# EAGLE design Flipdot_Driver (EAGLE 9.3.2)
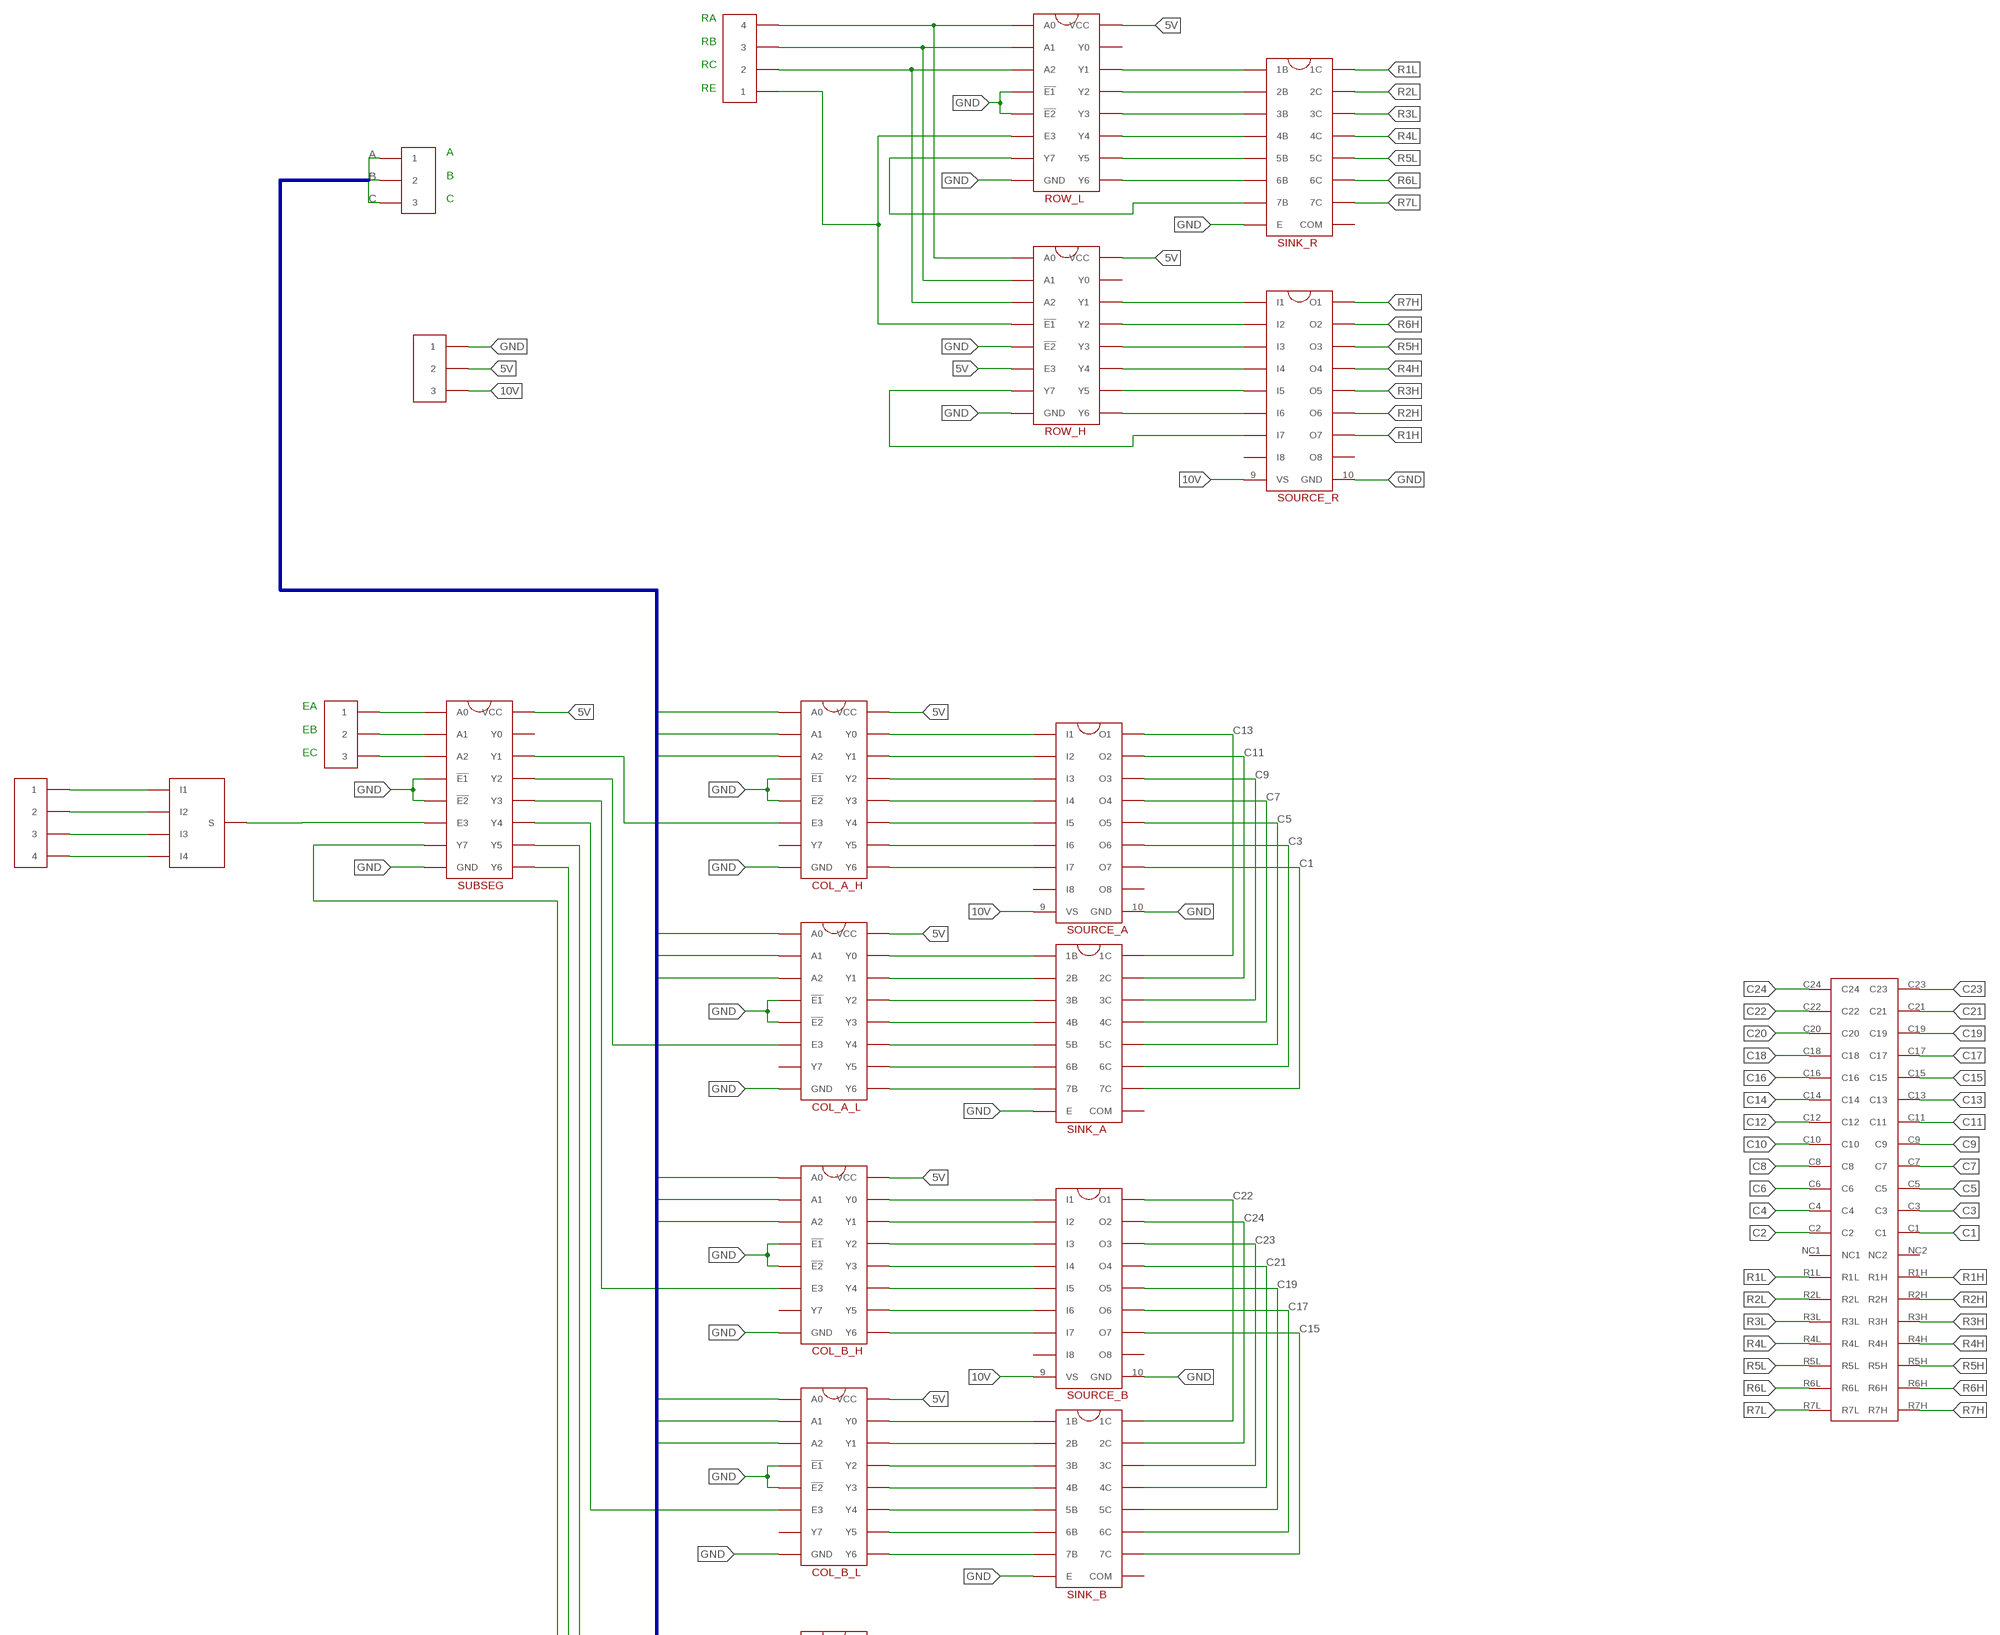
[diagram p0: schematic, sheet 1, part 1 of 2]
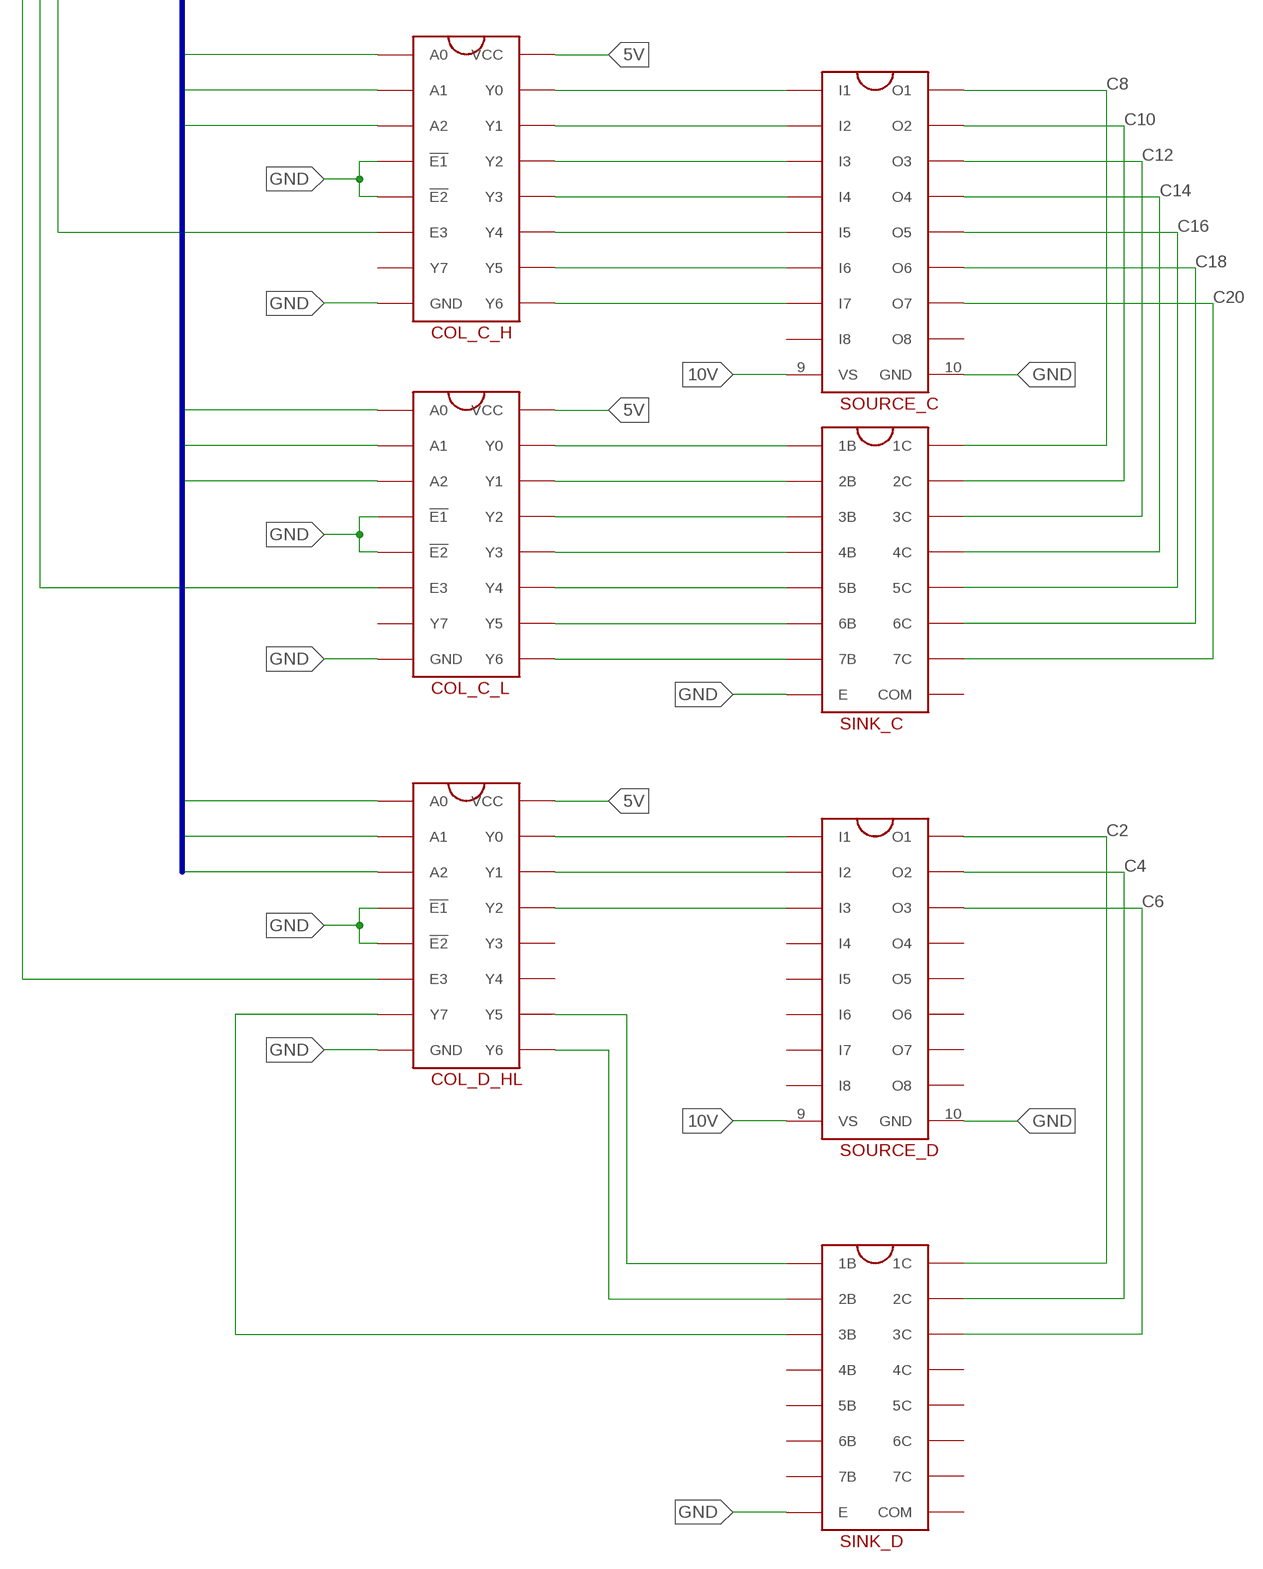
[diagram p1: schematic, sheet 1, part 2 of 2]

## Parts
COL_A_H  74HC238  [DIL16]
COL_A_L  74HC238  [DIL16]
COL_B_H  74HC238  [DIL16]
COL_B_L  74HC238  [DIL16]
COL_C_H  74HC238  [DIL16]
COL_C_L  74HC238  [DIL16]
COL_D_HL  74HC238  [DIL16]
ROW_H  74HC238  [DIL16]
ROW_L  74HC238  [DIL16]
SINK_A  ULN2003A  [DIL16]
SINK_B  ULN2003A  [DIL16]
SINK_C  ULN2003A  [DIL16]
SINK_D  ULN2003A  [DIL16]
SINK_R  ULN2003A  [DIL16]
SOURCE_A  UDN2981A  [DIL18]
SOURCE_B  UDN2981A  [DIL18]
SOURCE_C  UDN2981A  [DIL18]
SOURCE_D  UDN2981A  [DIL18]
SOURCE_R  UDN2981A  [DIL18]
SUBSEG  74HC238  [DIL16]
U$1  HEADER_40  [HEADER_40]
U$2  3_PIN  [3_PIN]
U$3  3_PIN  [3_PIN]
U$5  3_PIN  [3_PIN]
U$6  4_PIN  [4_PIN]
U$10  JUMPER  [JUMPER]
U$11  4_PIN  [4_PIN]

## Nets
5V: COL_A_H.16(VCC) COL_A_L.16(VCC) COL_B_H.16(VCC) COL_B_L.16(VCC) COL_C_H.16(VCC) COL_C_L.16(VCC) COL_D_HL.16(VCC) ROW_H.6(E3) ROW_H.16(VCC) ROW_L.16(VCC) SUBSEG.16(VCC) U$5.P$2
10V: SOURCE_A.9(VS) SOURCE_B.9(VS) SOURCE_C.9(VS) SOURCE_D.9(VS) SOURCE_R.9(VS) U$5.P$3
A: COL_A_H.1(A0) COL_A_L.1(A0) COL_B_H.1(A0) COL_B_L.1(A0) COL_C_H.1(A0) COL_C_L.1(A0) COL_D_HL.1(A0) U$2.P$1
B: COL_A_H.2(A1) COL_A_L.2(A1) COL_B_H.2(A1) COL_B_L.2(A1) COL_C_H.2(A1) COL_C_L.2(A1) COL_D_HL.2(A1) U$2.P$2
C: COL_A_H.3(A2) COL_A_L.3(A2) COL_B_H.3(A2) COL_B_L.3(A2) COL_C_H.3(A2) COL_C_L.3(A2) COL_D_HL.3(A2) U$2.P$3
C1: SINK_A.10(7C) SOURCE_A.12(O7) U$1.C1
C2: SINK_D.16(1C) SOURCE_D.18(O1) U$1.C2
C3: SINK_A.11(6C) SOURCE_A.13(O6) U$1.C3
C4: SINK_D.15(2C) SOURCE_D.17(O2) U$1.C4
C5: SINK_A.12(5C) SOURCE_A.14(O5) U$1.C5
C6: SINK_D.14(3C) SOURCE_D.16(O3) U$1.C6
C7: SINK_A.13(4C) SOURCE_A.15(O4) U$1.C7
C8: SINK_C.16(1C) SOURCE_C.18(O1) U$1.C8
C9: SINK_A.14(3C) SOURCE_A.16(O3) U$1.C9
C10: SINK_C.15(2C) SOURCE_C.17(O2) U$1.C10
C11: SINK_A.15(2C) SOURCE_A.17(O2) U$1.C11
C12: SINK_C.14(3C) SOURCE_C.16(O3) U$1.C12
C13: SINK_A.16(1C) SOURCE_A.18(O1) U$1.C13
C14: SINK_C.13(4C) SOURCE_C.15(O4) U$1.C14
C15: SINK_B.10(7C) SOURCE_B.12(O7) U$1.C15
C16: SINK_C.12(5C) SOURCE_C.14(O5) U$1.C16
C17: SINK_B.11(6C) SOURCE_B.13(O6) U$1.C17
C18: SINK_C.11(6C) SOURCE_C.13(O6) U$1.C18
C19: SINK_B.12(5C) SOURCE_B.14(O5) U$1.C19
C20: SINK_C.10(7C) SOURCE_C.12(O7) U$1.C20
C21: SINK_B.13(4C) SOURCE_B.15(O4) U$1.C21
C22: SINK_B.16(1C) SOURCE_B.18(O1) U$1.C22
C23: SINK_B.14(3C) SOURCE_B.16(O3) U$1.C23
C24: SINK_B.15(2C) SOURCE_B.17(O2) U$1.C24
GND: COL_A_H.4(!E1) COL_A_H.5(!E2) COL_A_H.8(GND) COL_A_L.4(!E1) COL_A_L.5(!E2) COL_A_L.8(GND) COL_B_H.4(!E1) COL_B_H.5(!E2) COL_B_H.8(GND) COL_B_L.4(!E1) COL_B_L.5(!E2) COL_B_L.8(GND) COL_C_H.4(!E1) COL_C_H.5(!E2) COL_C_H.8(GND) COL_C_L.4(!E1) COL_C_L.5(!E2) COL_C_L.8(GND) COL_D_HL.4(!E1) COL_D_HL.5(!E2) COL_D_HL.8(GND) ROW_H.5(!E2) ROW_H.8(GND) ROW_L.4(!E1) ROW_L.5(!E2) ROW_L.8(GND) SINK_A.8(E) SINK_B.8(E) SINK_C.8(E) SINK_D.8(E) SINK_R.8(E) SOURCE_A.10(GND) SOURCE_B.10(GND) SOURCE_C.10(GND) SOURCE_D.10(GND) SOURCE_R.10(GND) SUBSEG.4(!E1) SUBSEG.5(!E2) SUBSEG.8(GND) U$5.P$1
N$1: U$10.S1(I1) U$11.P$1
N$2: U$10.S2(I2) U$11.P$2
N$3: U$10.S3(I3) U$11.P$3
N$4: SUBSEG.1(A0) U$3.P$1
N$5: SUBSEG.2(A1) U$3.P$2
N$6: SUBSEG.3(A2) U$3.P$3
N$7: COL_A_L.6(E3) SUBSEG.13(Y2)
N$8: COL_B_H.6(E3) SUBSEG.12(Y3)
N$9: COL_A_H.6(E3) SUBSEG.14(Y1)
N$10: COL_B_L.6(E3) SUBSEG.11(Y4)
N$11: COL_C_H.6(E3) SUBSEG.10(Y5)
N$12: COL_C_L.6(E3) SUBSEG.9(Y6)
N$13: COL_D_HL.6(E3) SUBSEG.7(Y7)
N$14: COL_A_H.15(Y0) SOURCE_A.1(I1)
N$15: COL_A_H.14(Y1) SOURCE_A.2(I2)
N$16: COL_A_H.13(Y2) SOURCE_A.3(I3)
N$17: COL_A_H.12(Y3) SOURCE_A.4(I4)
N$18: COL_A_H.11(Y4) SOURCE_A.5(I5)
N$19: COL_A_H.10(Y5) SOURCE_A.6(I6)
N$20: COL_A_H.9(Y6) SOURCE_A.7(I7)
N$21: COL_B_H.15(Y0) SOURCE_B.1(I1)
N$22: COL_B_H.14(Y1) SOURCE_B.2(I2)
N$23: COL_B_H.13(Y2) SOURCE_B.3(I3)
N$24: COL_B_H.12(Y3) SOURCE_B.4(I4)
N$25: COL_B_H.11(Y4) SOURCE_B.5(I5)
N$26: COL_B_H.10(Y5) SOURCE_B.6(I6)
N$27: COL_B_H.9(Y6) SOURCE_B.7(I7)
N$28: COL_C_H.15(Y0) SOURCE_C.1(I1)
N$29: COL_C_H.14(Y1) SOURCE_C.2(I2)
N$30: COL_C_H.13(Y2) SOURCE_C.3(I3)
N$31: COL_C_H.12(Y3) SOURCE_C.4(I4)
N$32: COL_C_H.11(Y4) SOURCE_C.5(I5)
N$33: COL_C_H.10(Y5) SOURCE_C.6(I6)
N$34: COL_C_H.9(Y6) SOURCE_C.7(I7)
N$35: COL_D_HL.15(Y0) SOURCE_D.1(I1)
N$36: COL_D_HL.14(Y1) SOURCE_D.2(I2)
N$37: COL_D_HL.13(Y2) SOURCE_D.3(I3)
N$38: COL_A_L.15(Y0) SINK_A.1(1B)
N$39: COL_A_L.14(Y1) SINK_A.2(2B)
N$40: COL_A_L.13(Y2) SINK_A.3(3B)
N$41: COL_A_L.12(Y3) SINK_A.4(4B)
N$42: COL_A_L.11(Y4) SINK_A.5(5B)
N$43: COL_A_L.10(Y5) SINK_A.6(6B)
N$44: COL_A_L.9(Y6) SINK_A.7(7B)
N$45: COL_B_L.15(Y0) SINK_B.1(1B)
N$46: COL_B_L.14(Y1) SINK_B.2(2B)
N$47: COL_B_L.13(Y2) SINK_B.3(3B)
N$48: COL_B_L.12(Y3) SINK_B.4(4B)
N$49: COL_B_L.11(Y4) SINK_B.5(5B)
N$50: COL_B_L.10(Y5) SINK_B.6(6B)
N$51: COL_B_L.9(Y6) SINK_B.7(7B)
N$52: COL_C_L.15(Y0) SINK_C.1(1B)
N$53: COL_C_L.14(Y1) SINK_C.2(2B)
N$54: COL_C_L.13(Y2) SINK_C.3(3B)
N$55: COL_C_L.12(Y3) SINK_C.4(4B)
N$56: COL_C_L.11(Y4) SINK_C.5(5B)
N$57: COL_C_L.10(Y5) SINK_C.6(6B)
N$58: COL_C_L.9(Y6) SINK_C.7(7B)
N$59: COL_D_HL.10(Y5) SINK_D.1(1B)
N$60: COL_D_HL.9(Y6) SINK_D.2(2B)
N$61: COL_D_HL.7(Y7) SINK_D.3(3B)
N$62: ROW_H.1(A0) ROW_L.1(A0) U$6.P$4
N$63: ROW_H.2(A1) ROW_L.2(A1) U$6.P$3
N$64: ROW_H.3(A2) ROW_L.3(A2) U$6.P$2
N$65: ROW_H.4(!E1) ROW_L.6(E3) U$6.P$1
N$66: ROW_L.14(Y1) SINK_R.1(1B)
N$67: ROW_L.13(Y2) SINK_R.2(2B)
N$68: ROW_L.12(Y3) SINK_R.3(3B)
N$69: ROW_L.11(Y4) SINK_R.4(4B)
N$70: ROW_L.10(Y5) SINK_R.5(5B)
N$71: ROW_L.9(Y6) SINK_R.6(6B)
N$72: ROW_L.7(Y7) SINK_R.7(7B)
N$73: ROW_H.14(Y1) SOURCE_R.1(I1)
N$74: ROW_H.13(Y2) SOURCE_R.2(I2)
N$75: ROW_H.12(Y3) SOURCE_R.3(I3)
N$76: ROW_H.11(Y4) SOURCE_R.4(I4)
N$77: ROW_H.10(Y5) SOURCE_R.5(I5)
N$78: ROW_H.9(Y6) SOURCE_R.6(I6)
N$79: ROW_H.7(Y7) SOURCE_R.7(I7)
N$80: U$10.S4(I4) U$11.P$4
R1H: SOURCE_R.12(O7) U$1.R1H
R1L: SINK_R.16(1C) U$1.R1L
R2H: SOURCE_R.13(O6) U$1.R2H
R2L: SINK_R.15(2C) U$1.R2L
R3H: SOURCE_R.14(O5) U$1.R3H
R3L: SINK_R.14(3C) U$1.R3L
R4H: SOURCE_R.15(O4) U$1.R4H
R4L: SINK_R.13(4C) U$1.R4L
R5H: SOURCE_R.16(O3) U$1.R5H
R5L: SINK_R.12(5C) U$1.R5L
R6H: SOURCE_R.17(O2) U$1.R6H
R6L: SINK_R.11(6C) U$1.R6L
R7H: SOURCE_R.18(O1) U$1.R7H
R7L: SINK_R.10(7C) U$1.R7L
SEG_1: SUBSEG.6(E3) U$10.X1(S) U$10.X2(S) U$10.X3(S) U$10.X4(S)
Unconnected: COL_A_H.7(Y7) COL_A_L.7(Y7) COL_B_H.7(Y7) COL_B_L.7(Y7) COL_C_H.7(Y7) COL_C_L.7(Y7) COL_D_HL.11(Y4) COL_D_HL.12(Y3) ROW_H.15(Y0) ROW_L.15(Y0) SINK_A.9(COM) SINK_B.9(COM) SINK_C.9(COM) SINK_D.4(4B) SINK_D.5(5B) SINK_D.6(6B) SINK_D.7(7B) SINK_D.9(COM) SINK_D.10(7C) SINK_D.11(6C) SINK_D.12(5C) SINK_D.13(4C) SINK_R.9(COM) SOURCE_A.8(I8) SOURCE_A.11(O8) SOURCE_B.8(I8) SOURCE_B.11(O8) SOURCE_C.8(I8) SOURCE_C.11(O8) SOURCE_D.4(I4) SOURCE_D.5(I5) SOURCE_D.6(I6) SOURCE_D.7(I7) SOURCE_D.8(I8) SOURCE_D.11(O8) SOURCE_D.12(O7) SOURCE_D.13(O6) SOURCE_D.14(O5) SOURCE_D.15(O4) SOURCE_R.8(I8) SOURCE_R.11(O8) SUBSEG.15(Y0) U$1.NC1 U$1.NC2

## Buses
CODE3WIRE:A,B,C

## Notes on the sheet
- RA
  
  RB
  
  RC
  
  RE
- A
  
  B
  
  C
- EA
  
  EB
  
  EC

## Library data of the parts
COL_A_H COL_A_L COL_B_H COL_B_L COL_C_H COL_C_L COL_D_HL ROW_H ROW_L SUBSEG = Flipdot:74HC238: Demultiplexer
SINK_A SINK_B SINK_C SINK_D SINK_R = Flipdot:ULN2003A: Darlington Array
SOURCE_A SOURCE_B SOURCE_C SOURCE_D SOURCE_R = Flipdot:UDN2981A: Source driver
U$1 = Flipdot:HEADER_40
U$2 U$3 U$5 = Flipdot:3_PIN
U$6 U$11 = Flipdot:4_PIN
U$10 = Flipdot:JUMPER

## Board
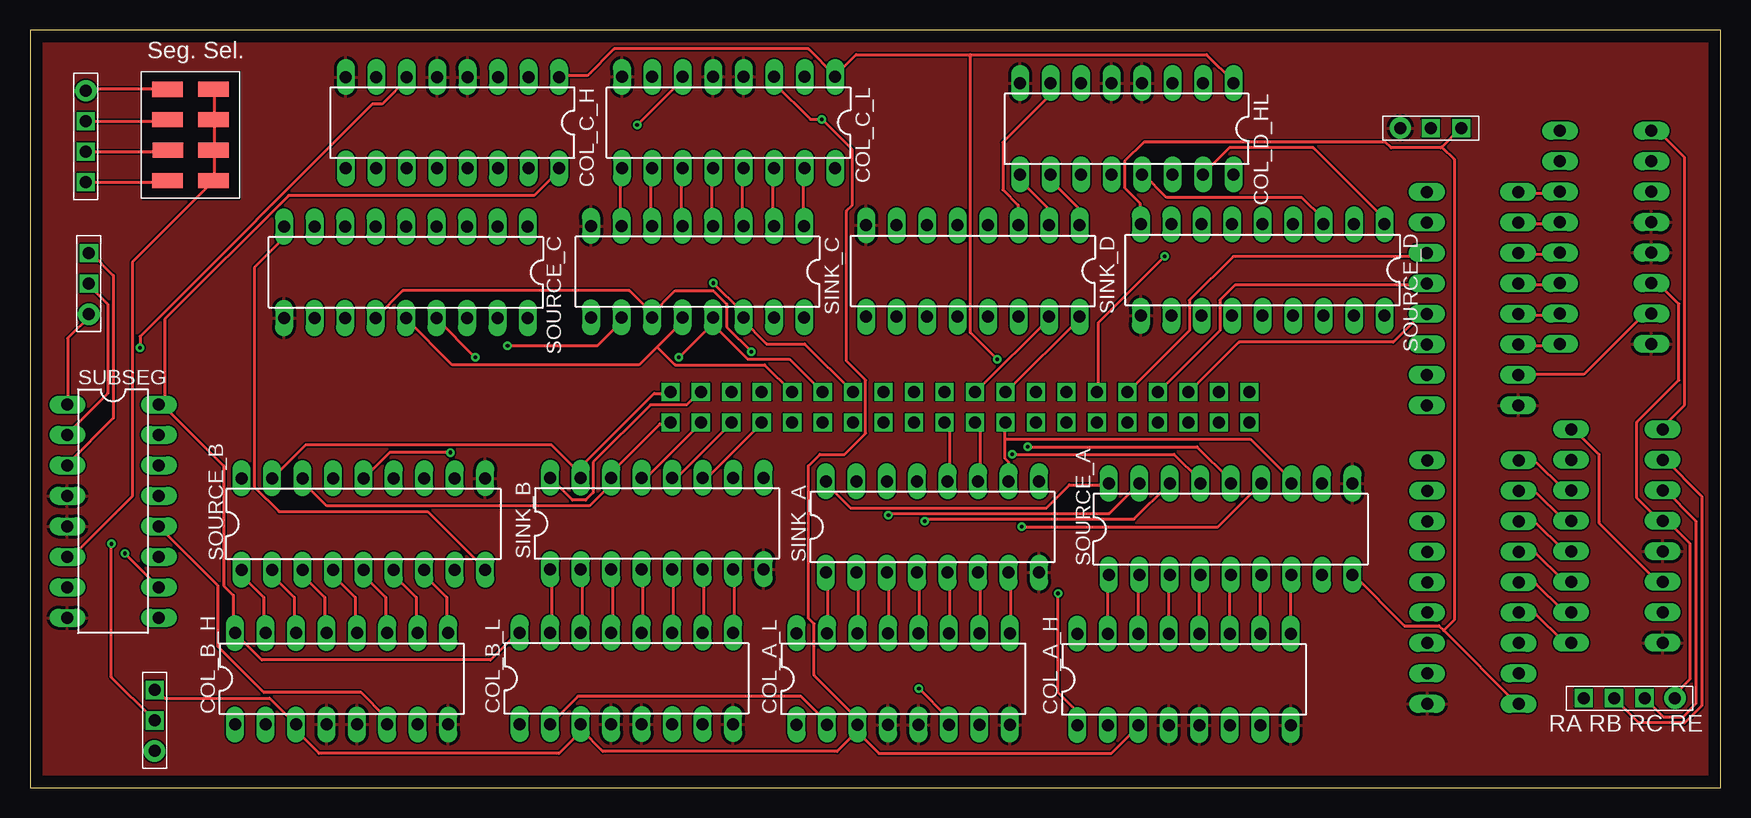
[diagram p2: board, top side]
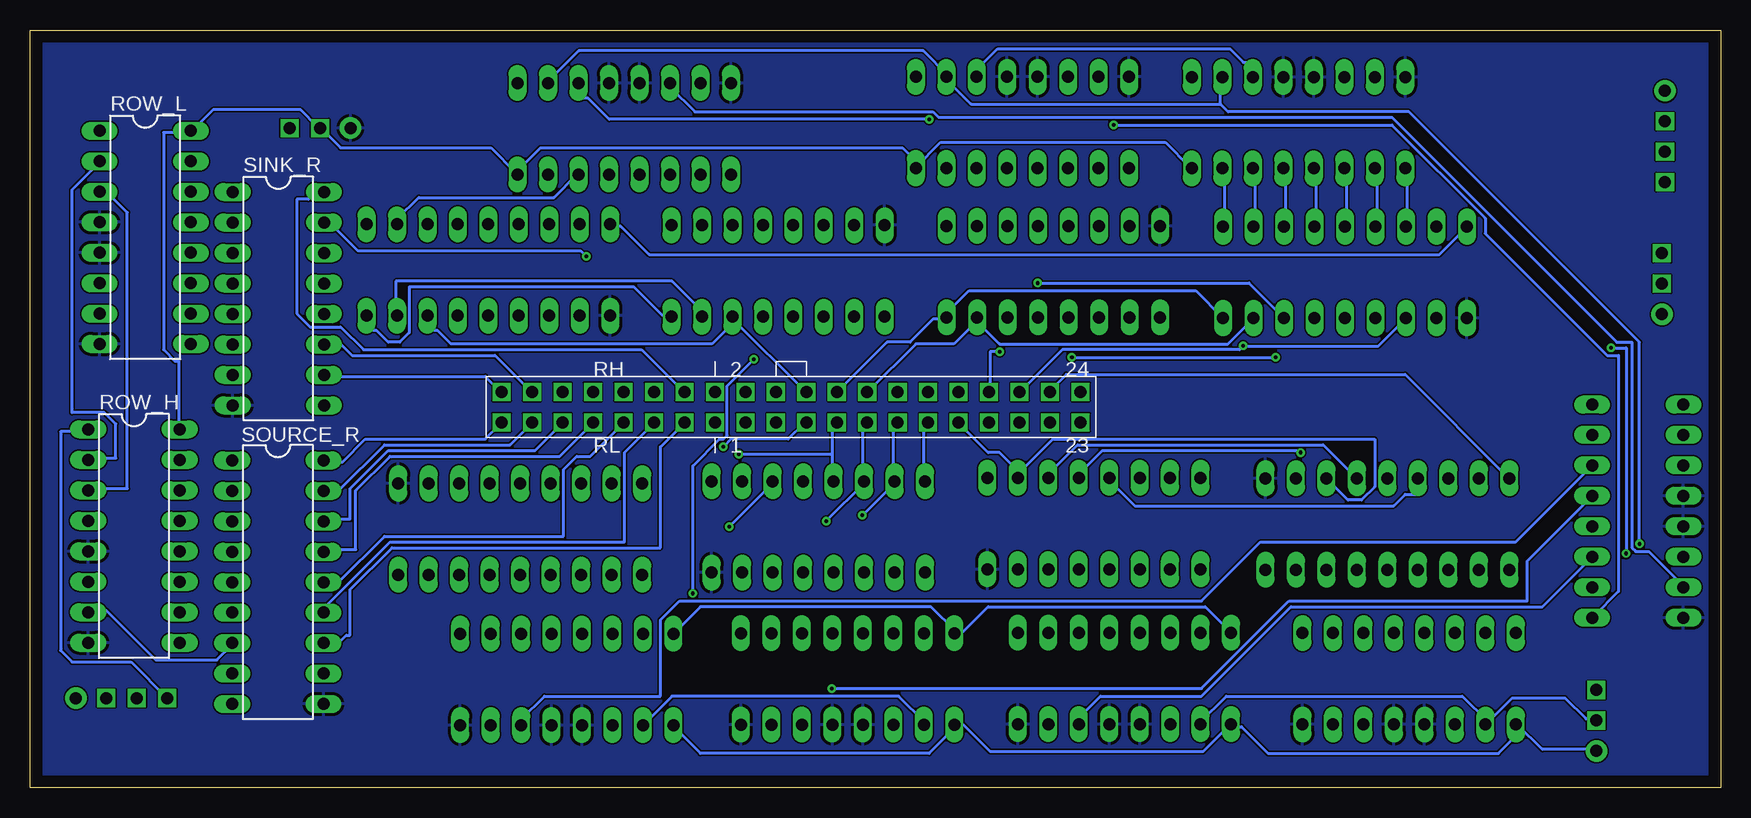
[diagram p3: board, bottom side, seen from below]

Size 140.95 x 63.17 mm. Coordinates in mm from the lower left corner, seen from the top.
Outline: 0,0 140.95,0 140.95,63.17 0,63.17 0,0
Copper layers (1*16): Top 0.035mm / dielectric 1.5mm / Bottom 0.035mm
Design rules "JLC *": minimum track width 10mil, minimum drill 0.3mm, track to track 5mil, track to pad 5mil, pad to pad 5mil, via to via 5mil, smd to smd 5mil, copper to edge 40mil, drill to drill 1mm, minimum pad ring 10mil, minimum via ring 8mil, stop-mask expansion 4mil, vias tented up to drill 0mil, thermal gap 10mil

### Footprints (pad centres in the part's own frame; a part is rotated, then mirrored left to right if it is on the bottom)
DIL16 = drill 1 long: 1 -8.89,-3.81; 2 -6.35,-3.81; 3 -3.81,-3.81; 4 -1.27,-3.81; 5 1.27,-3.81; 6 3.81,-3.81; 7 6.35,-3.81; 8 8.89,-3.81; 9 8.89,3.81; 10 6.35,3.81; 11 3.81,3.81; 12 1.27,3.81; 13 -1.27,3.81; 14 -3.81,3.81; 15 -6.35,3.81; 16 -8.89,3.81
DIL18 = drill 1 long: 1 -10.16,-3.81; 2 -7.62,-3.81; 3 -5.08,-3.81; 4 -2.54,-3.81; 5 0,-3.81; 6 2.54,-3.81; 7 5.08,-3.81; 8 7.62,-3.81; 9 10.16,-3.81; 10 10.16,3.81; 11 7.62,3.81; 12 5.08,3.81; 13 2.54,3.81; 14 0,3.81; 15 -2.54,3.81; 16 -5.08,3.81; 17 -7.62,3.81; 18 -10.16,3.81
HEADER_40 = drill 1 square: C1 -2.54,-2.54; C2 -2.54,0; C3 0,-2.54; C4 0,0; C5 2.54,-2.54; C6 2.54,0; C7 5.08,-2.54; C8 5.08,0; C9 7.62,-2.54; C10 7.62,0; C11 10.16,-2.54; C12 10.16,0; C13 12.7,-2.54; C14 12.7,0; C15 15.24,-2.54; C16 15.24,0; C17 17.78,-2.54; C18 17.78,0; C19 20.32,-2.54; C20 20.32,0; C21 22.86,-2.54; C22 22.86,0; C23 25.4,-2.54; C24 25.4,0; NC1 -5.08,0; NC2 -5.08,-2.54; R1H -7.62,-2.54; R1L -7.62,0; R2H -10.16,-2.54; R2L -10.16,0; R3H -12.7,-2.54; R3L -12.7,0; R4H -15.24,-2.54; R4L -15.24,0; R5H -17.78,-2.54; R5L -17.78,0; R6H -20.32,-2.54; R6L -20.32,0; R7H -22.86,-2.54; R7L -22.86,0
3_PIN = drill 1 pad 1.778: P$1 -2.54,0 | drill 1 square: P$2 0,0; P$3 2.54,0
4_PIN = drill 1 pad 1.778: P$1 -2.54,0 | drill 1 square: P$2 0,0; P$3 2.54,0; P$4 5.08,0
JUMPER = smd 1.27 x 2.54: S1 -3.756,-1.888; S2 -1.242,-1.908; S3 1.298,-1.877; S4 3.838,-1.897; X1 -3.787,1.922; X2 -1.247,1.928; X3 1.293,1.933; X4 3.833,1.939

### Placement (x,y rotation side)
COL_A_H  96.2,9.01 0 top
COL_A_L  72.79,9.06 0 top
COL_B_H  25.98,9.07 0 top
COL_B_L  49.72,9.1 0 top
COL_C_H  35.21,55.44 180 top
COL_C_L  58.22,55.46 180 top
COL_D_HL  91.42,54.93 180 top
ROW_H  132.28,20.97 270 bottom
ROW_L  131.35,45.87 270 bottom
SINK_A  75.23,21.73 0 top
SINK_B  52.26,22.01 0 top
SINK_C  55.65,43.01 180 top
SINK_D  78.6,43.08 180 top
SINK_R  120.25,40.77 270 bottom
SOURCE_A  100.09,21.55 0 top
SOURCE_B  27.79,21.98 0 top
SOURCE_C  31.34,42.96 180 top
SOURCE_D  102.75,43.16 180 top
SOURCE_R  120.29,17.13 270 bottom
SUBSEG  6.93,23.05 270 top
U$1  78.78,32.99 0 bottom
U$2  10.38,5.59 90 top
U$3  4.91,42.02 90 top
U$5  116.77,54.99 0 top
U$6  134.58,7.46 180 top
U$10  13.36,54.45 270 top
U$11  4.66,55.56 270 top

### Tracks (layer width: path | path; a pad name or v marks a point on that pad's centre or on a via)
5V
  Top 0.254: COL_B_L.16 40.76,13.02 38.38,10.63 19.33,10.63 17.11,12.86 COL_B_H.16 16.95,13.02 16.95,16.03 16.16,16.83 16.16,26.83 11.08,31.91 10.76,31.91 SUBSEG.16 11.24,31.91 11.24,39.05 21.55,49.37 42.03,49.37 44.26,51.59 COL_C_H.16 | ROW_H.6 136.01,17.3 135.54,17.3 130.77,22.06 130.77,27.78 128.55,30 ROW_H.16
  Bottom 0.254: 63.78,13.02 63.15,13.02 61.08,15.08 42.99,15.08 40.92,13.02 COL_B_L.16 | 63.78,13.02 65.85,15.08 85.06,15.08 87.28,12.86 COL_A_H.16 | 63.78,13.02 COL_A_L.16 | COL_C_H.16 44.26,51.75 46.32,53.81 65.05,53.81 67.12,51.75 COL_C_L.16 66.96,52.07 68.23,53.34 98.39,53.34 100.3,51.43 100.45,51.43 COL_D_HL.16 100.45,51.27 102.52,53.34 115.06,53.34 116.65,54.93 U$5.P$2 116.81,55.09 116.96,55.09 118.39,56.51 125.7,56.51 127.44,54.77 ROW_L.16 127.6,54.61 129.82,54.61 129.82,36.51 128.87,35.56 128.55,35.56 128.55,30 ROW_H.16
10V
  Top 0.254: SOURCE_B.9 37.91,18.26 33.14,23.02 20.76,23.02 18.7,25.08 18.7,43.34 21.08,45.72 21.08,46.67 SOURCE_C.9 | 117.84,13.1 117.44,13.49 114.58,13.49 110.3,17.78 SOURCE_A.9 | 117.84,13.1 123.95,6.98 SOURCE_R.9 | 117.68,53.42 119.19,54.93 U$5.P$3 | 117.68,53.42 117.6,53.34 113.47,53.34 113,53.81 92.83,53.81 91.25,52.23 91.25,50 92.52,48.73 92.52,46.99 SOURCE_D.9 | 117.84,13.1 118.71,13.97 118.71,52.39 117.68,53.42
  Bottom 0.254: SOURCE_C.9 21.24,46.67 23.46,44.45 89.34,44.45 91.72,46.83 92.52,46.83 SOURCE_D.9
A  (via drill 0.3)
  Top 0.254: 67.12,59.37 64.89,61.59 48.7,61.59 46.48,59.37 44.26,59.37 COL_C_H.1 | 78.39,61.12 68.86,61.12 67.12,59.37 | 78.39,61.12 98.07,61.12 100.3,58.9 COL_D_HL.1 | 67.12,59.37 COL_C_L.1 | 78.39,61.12 78.39,37.94 v80.61,35.72 | v85.69,16.19 85.69,7.94 87.28,6.35 87.28,5.24 COL_A_H.1
  Bottom 0.254: U$2.P$1 10.44,3.17 14.89,3.17 16.95,5.24 COL_B_H.1 16.63,4.76 18.54,2.86 37.75,2.86 39.97,5.08 40.92,5.08 COL_B_L.1 40.92,5.24 43.14,3.02 60.93,3.02 63.15,5.24 63.62,5.24 | 63.62,5.24 63.78,5.24 COL_A_L.1 63.62,5.24 | 63.62,5.24 66.01,2.86 85.06,2.86 87.28,5.08 COL_A_H.1 | v80.61,35.72 82.83,33.49 82.83,29.37 83.15,29.05 83.47,29.05 85.69,26.83 v85.69,16.19
B  (via drill 0.3)
  Top 0.254: COL_B_L.2 43.46,5.4 45.68,7.62 64.26,7.62 66.48,5.4 COL_A_L.2 | v6.79,20.32 6.79,9.21 10.28,5.71 U$2.P$2
  Bottom 0.254: 41.72,56.99 41.72,59.21 COL_C_H.2 | 41.72,56.99 62.51,56.99 64.42,58.9 64.42,59.21 COL_C_L.2 64.42,59.37 66.48,61.43 95.22,61.43 97.76,58.9 COL_D_HL.2 | U$2.P$2 10.44,5.71 11.24,5.71 12.98,7.46 17.43,7.46 19.49,5.4 COL_B_H.2 19.49,5.55 21.55,7.62 41.24,7.62 43.46,5.4 COL_B_L.2 | COL_A_H.2 89.82,5.24 87.44,7.62 68.55,7.62 66.32,5.4 COL_A_L.2 | 41.72,56.99 41.08,56.35 26,56.35 6.79,37.15 v6.79,20.32
C  (via drill 0.3)
  Top 0.254: COL_C_L.3 62.04,59.21 62.04,58.74 65.05,55.72 v66.01,55.72 68.55,53.18 68.55,48.58 68.07,48.1 68.07,35.56 69.66,33.97 69.66,29.53 67.91,27.78 65.85,27.78 64.89,26.83 64.89,14.13 65.37,13.65 65.37,9.37 68.86,5.87 68.86,5.4 COL_A_L.3 | U$2.P$3 10.44,8.25 11.24,7.46 19.97,7.46 22.03,5.4 COL_B_H.3 22.19,5.24 22.19,4.76 24.09,2.86 44.1,2.86 46,4.76 | 69.02,4.76 69.02,5.24 COL_A_L.3 | 69.02,4.76 69.02,4.6 70.77,2.86 90.14,2.86 92.36,5.08 COL_A_H.3 | 46,4.76 46,5.24 COL_B_L.3 46,4.76 | 46,4.76 47.75,3.02 67.28,3.02 69.02,4.76 | 69.02,4.76 COL_A_L.3
  Bottom 0.254: COL_C_H.3 39.18,59.37 39.18,60.48 39.81,60.48 40.92,61.59 60.29,61.59 61.88,60.01 61.88,59.37 COL_C_L.3 | v66.01,55.72 92.68,55.72 94.42,57.47 95.22,57.47 95.22,58.74 COL_D_HL.3
C1
  Top 0.254: 81.25,29.05 81.25,30.32 U$1.C1 | 81.25,29.05 81.25,27.46 81.56,27.14 81.56,25.56 SINK_A.10 | 81.25,29.05 101.72,29.05 105.06,25.72 105.06,25.4 SOURCE_A.12
C2
  Top 0.254: U$1.C2 81.4,33.02 87.59,39.21 SINK_D.16
  Bottom 0.254: SOURCE_D.18 112.84,39.21 112.84,38.1 112.04,38.1 111.09,37.15 110.14,37.15 109.34,37.94 109.34,41.75 90.61,41.75 88.23,39.37 87.59,39.37 SINK_D.16
C3  (via drill 0.3)
  Top 0.254: SINK_A.11 79.18,25.56 79.18,30 78.86,30.32 U$1.C3 | v82.67,21.75 99.03,21.75 102.52,25.24 SOURCE_A.13
  Bottom 0.254: v82.67,21.75 79.02,25.4 SINK_A.11
C4
  Top 0.254: U$1.C4 78.86,33.02 85.06,39.21 SINK_D.15
  Bottom 0.254: SOURCE_D.17 110.45,39.37 110.45,42.23 87.44,42.23 85.06,39.84 85.06,39.37 SINK_D.15
C5  (via drill 0.3)
  Top 0.254: SINK_A.12 76.64,25.56 76.64,30 76.32,30.32 U$1.C5 | v83.15,28.41 97.28,28.41 99.98,25.72 99.98,25.4 SOURCE_A.14
  Bottom 0.254: v83.15,28.41 82.52,29.05 77.75,29.05 76.48,30.32 76.32,30.32 U$1.C5
C6
  Bottom 0.254: U$1.C6 76.32,33.02 82.52,39.21 SINK_D.14 82.2,38.73 82.36,38.73 84.1,36.99 105.85,36.99 106.96,38.1 107.76,38.1 107.76,39.21 SOURCE_D.16
C7  (via drill 0.3)
  Top 0.254: v81.88,27.78 95.37,27.78 97.44,25.72 97.44,25.4 SOURCE_A.15
  Bottom 0.254: 74.1,27.78 74.1,30.32 73.78,30.32 U$1.C7 | 74.1,27.78 74.1,25.56 SINK_A.13 | 74.1,27.78 v81.88,27.78
C8
  Bottom 0.254: SOURCE_C.18 41.56,39.21 43.78,41.43 62.67,41.43 64.42,39.69 64.42,39.21 SINK_C.16 64.58,39.05 65.69,39.05 67.59,37.15 69.5,37.15 73.62,33.02 U$1.C8
C9  (via drill 0.3)
  Top 0.254: v74.58,22.22 74.74,22.38 92.04,22.38 94.9,25.24 SOURCE_A.16
  Bottom 0.254: U$1.C9 71.24,30.32 71.56,30.32 71.56,25.56 SINK_A.14 71.4,25.4 v74.58,22.22
C10
  Bottom 0.254: SOURCE_C.17 39.02,39.05 41.08,36.99 60.13,36.99 61.88,38.73 61.88,39.05 SINK_C.15 61.88,38.57 62.35,38.57 63.94,36.99 67.12,36.99 71.09,33.02 U$1.C10
C11  (via drill 0.3)
  Top 0.254: v71.56,22.7 71.72,22.86 89.98,22.86 92.36,25.24 SOURCE_A.17
  Bottom 0.254: U$1.C11 68.7,30.32 69.02,30.32 69.02,25.56 SINK_A.15 68.86,25.4 v71.56,22.7
C12  (via drill 0.3)
  Top 0.254: v56.96,42.07 59.34,39.69 59.34,39.21 SINK_C.14 59.34,39.05 61.4,36.99 64.58,36.99 68.55,33.02 U$1.C12
  Bottom 0.254: v56.96,42.07 39.34,42.07 36.48,39.21 SOURCE_C.16
C13
  Top 0.254: SOURCE_A.18 89.82,25.24 86.64,25.24 84.74,23.34 68.39,23.34 66.32,25.4 SINK_A.16
  Bottom 0.254: SINK_A.16 66.48,25.56 66.48,30.32 66.16,30.32 U$1.C13
C14  (via drill 0.3)
  Top 0.254: v37.11,35.88 33.94,39.05 SOURCE_C.15 | v54.1,35.88 56.8,38.57 56.8,38.73 | 56.8,38.73 56.8,39.05 SINK_C.13 56.8,38.73 | 56.8,38.73 59.81,35.72 63.31,35.72 66.01,33.02 U$1.C14
  Bottom 0.254: v54.1,35.88 v37.11,35.88
C15
  Bottom 0.254: SOURCE_B.12 32.83,25.72 31.08,23.97 29.97,23.97 28.86,25.08 28.86,29.05 55.69,29.05 58.54,26.19 58.54,25.88 SINK_B.10 58.54,26.35 60.13,27.94 61.08,27.94 63.46,30.32 U$1.C15
C16
  Top 0.254: 52.27,36.75 54.26,38.73 54.26,39.05 SINK_C.12 | 52.27,36.75 50.77,35.24 35.21,35.24 31.4,39.05 SOURCE_C.14 | 52.27,36.75 53.78,35.24 61.24,35.24 63.46,33.02 U$1.C16
C17
  Top 0.254: U$1.C17 60.93,30.32 56.48,25.88 56.16,25.88 SINK_B.11
  Bottom 0.254: SOURCE_B.13 30.45,25.88 33.14,28.57 53.62,28.57 56,26.19 56,25.88 SINK_B.11
C18  (via drill 0.3)
  Top 0.254: 51.72,39.37 51.72,39.21 SINK_C.11 51.72,39.37 | 51.72,39.37 51.72,39.69 49.97,41.43 31.08,41.43 28.86,39.21 SOURCE_C.13 | v60.13,36.35 58.07,38.42 58.07,40.32 56.96,41.43 53.78,41.43 51.72,39.37
  Bottom 0.254: v60.13,36.35 60.93,36.35 60.93,33.02 U$1.C18
C19  (via drill 0.3)
  Top 0.254: v35.05,27.94 29.97,27.94 27.91,25.88 SOURCE_B.14 | U$1.C19 58.38,30.32 53.94,25.88 53.62,25.88 SINK_B.12
  Bottom 0.254: v35.05,27.94 35.21,28.1 51.56,28.1 53.46,26.19 53.46,25.88 SINK_B.12
C20  (via drill 0.3)
  Top 0.254: v39.81,36.83 47.27,36.83 49.18,38.73 49.18,39.05 SINK_C.10
  Bottom 0.254: SOURCE_C.12 26.32,39.05 28.54,36.83 v39.81,36.83 40.13,36.51 54.89,36.51 58.38,33.02 U$1.C20
C21
  Top 0.254: U$1.C21 55.84,30.32 51.4,25.88 51.08,25.88 SINK_B.13
  Bottom 0.254: SOURCE_B.15 25.37,25.72 25.37,24.45 26.32,24.45 27.27,23.49 48.86,23.49 51.08,25.72 SINK_B.13
C22
  Top 0.254: SINK_B.16 43.46,25.72 45.21,23.97 46.32,23.97 46.95,24.6 46.95,27.14 51.72,31.91 54.73,31.91 55.84,33.02 U$1.C22
  Bottom 0.254: SOURCE_B.18 17.74,25.88 26.32,34.45 54.57,34.45 56,33.02 U$1.C22
C23
  Top 0.254: SOURCE_B.16 22.83,25.72 22.83,25.4 24.73,23.49 46.64,23.49 48.38,25.24 48.38,25.72 SINK_B.14 48.54,25.88 48.54,26.35 52.51,30.32 53.3,30.32 U$1.C23
C24
  Top 0.254: SOURCE_B.17 20.28,25.88 22.98,28.57 43.46,28.57 45.84,26.19 45.84,25.88 SINK_B.15 45.68,26.51 52.03,32.86 53.3,32.86 U$1.C24
CUT
  cutout Top: 9.36,49.12 17.49,49.12 17.49,59.66 9.36,59.66
GND
  pour Top: -0.04,63.34 140.94,63.34 140.94,-0.16 -0.04,-0.16
  pour Bottom: -0.04,-0.16 -0.04,63.34 140.94,63.34 140.94,-0.16
N$1
  Top 0.254: U$10.S1 11.4,58.26 4.89,58.26 4.73,58.1 U$11.P$1
N$2
  Top 0.254: U$10.S2 11.4,55.56 4.73,55.56 U$11.P$2
N$3
  Top 0.254: U$10.S3 11.4,53.02 4.73,53.02 U$11.P$3
N$4
  Top 0.254: SUBSEG.1 3.14,32.07 3.14,37.46 5.04,39.37 U$3.P$1
N$5
  Top 0.254: SUBSEG.2 3.14,29.53 6.47,32.86 6.47,40.32 4.89,41.91 U$3.P$2
N$6
  Top 0.254: SUBSEG.3 3.14,26.99 6.95,30.8 6.95,42.7 5.04,44.61 U$3.P$3
N$7  (via drill 0.3)
  Top 0.254: v74.1,8.25 76.48,5.87 76.48,5.4 COL_A_L.6
  Bottom 0.254: v74.1,8.25 43.3,8.25 36,15.56 16.16,15.56 16.16,18.89 10.76,24.29 SUBSEG.13
N$8
  Top 0.254: SUBSEG.12 10.76,21.75 15.68,16.83 15.68,11.75 19.49,7.94 27.59,7.94 29.65,5.87 29.65,5.4 COL_B_H.6
N$9
  Bottom 0.254: SUBSEG.14 10.76,26.83 17.11,20.48 38.38,20.48 43.3,15.56 86.8,15.56 88.39,13.97 88.39,7.62 98.07,7.62 99.98,5.71 99.98,5.24 COL_A_H.6
N$10
  Bottom 0.254: SUBSEG.11 10.76,19.21 14.89,15.08 35.84,15.08 43.3,7.62 51.72,7.62 53.46,5.87 53.46,5.4 COL_B_L.6
N$11  (via drill 0.3)
  Top 0.254: v7.9,19.52 10.6,16.83 SUBSEG.10 | v9.17,36.67 9.17,37.62 28.54,56.99 29.33,56.99 31.56,59.21 COL_C_H.6
  Bottom 0.254: v7.9,19.52 7.9,36.67 v9.17,36.67
N$12  (via drill 0.3)
  Top 0.254: v50.61,55.24 54.26,58.9 54.26,59.21 COL_C_L.6
  Bottom 0.254: v50.61,55.24 27.43,55.24 19.65,47.46 19.65,46.2 9.49,36.03 8.54,36.03 8.54,16.35 10.6,14.29 SUBSEG.9
N$13
  Bottom 0.254: SUBSEG.7 3.14,16.83 6,19.68 7.11,19.68 7.43,20 7.43,37.15 8.7,37.15 27.43,55.88 65.21,55.88 65.69,56.35 85.53,56.35 87.59,58.42 87.59,58.74 COL_D_HL.6
N$14
  Top 0.254: COL_A_H.15 89.82,12.86 89.82,17.62 SOURCE_A.1
N$15
  Top 0.254: COL_A_H.14 92.36,12.86 92.36,17.62 SOURCE_A.2
N$16
  Top 0.254: COL_A_H.13 94.9,12.86 94.9,17.62 SOURCE_A.3
N$17
  Top 0.254: COL_A_H.12 97.44,12.86 97.44,17.62 SOURCE_A.4
N$18
  Top 0.254: COL_A_H.11 99.98,12.86 99.98,17.62 SOURCE_A.5
N$19
  Top 0.254: COL_A_H.10 102.52,12.86 102.52,17.62 SOURCE_A.6
N$20
  Top 0.254: COL_A_H.9 105.06,12.86 105.06,17.62 SOURCE_A.7
N$21
  Top 0.254: COL_B_H.15 19.49,13.02 19.49,15.87 17.74,17.62 17.74,18.1 SOURCE_B.1
N$22
  Top 0.254: COL_B_H.14 22.03,13.02 22.03,15.87 20.28,17.62 20.28,18.1 SOURCE_B.2
N$23
  Top 0.254: COL_B_H.13 24.57,13.02 24.57,15.87 22.83,17.62 22.83,18.1 SOURCE_B.3
N$24
  Top 0.254: COL_B_H.12 27.11,13.02 27.11,15.87 25.37,17.62 25.37,18.1 SOURCE_B.4
N$25
  Top 0.254: COL_B_H.11 29.65,13.02 29.65,15.87 27.91,17.62 27.91,18.1 SOURCE_B.5
N$26
  Top 0.254: COL_B_H.10 32.19,13.02 32.19,15.87 30.45,17.62 30.45,18.1 SOURCE_B.6
N$27
  Top 0.254: COL_B_H.9 34.73,13.02 34.73,15.87 32.98,17.62 32.98,18.1 SOURCE_B.7
N$28
  Bottom 0.254: SOURCE_C.1 41.4,46.83 41.4,51.59 41.56,51.59 COL_C_H.15
N$29
  Bottom 0.254: SOURCE_C.2 38.86,46.83 38.86,51.59 39.02,51.59 COL_C_H.14
N$30
  Bottom 0.254: SOURCE_C.3 36.32,46.83 36.32,51.59 36.48,51.59 COL_C_H.13
N$31
  Bottom 0.254: SOURCE_C.4 33.78,46.83 33.78,51.59 33.94,51.59 COL_C_H.12
N$32
  Bottom 0.254: SOURCE_C.5 31.24,46.83 31.24,51.59 31.4,51.59 COL_C_H.11
N$33
  Bottom 0.254: SOURCE_C.6 28.7,46.83 28.7,51.59 28.86,51.59 COL_C_H.10
N$34
  Bottom 0.254: SOURCE_C.7 26.16,46.83 26.16,51.59 26.32,51.59 COL_C_H.9
N$35
  Top 0.254: COL_D_HL.15 97.91,51.27 99.98,53.34 106.96,53.34 112.84,47.46 112.84,46.99 SOURCE_D.1
N$36
  Bottom 0.254: COL_D_HL.14 95.37,51.12 97.28,49.21 108.55,49.21 110.3,47.46 110.3,46.99 SOURCE_D.2
N$37
  Top 0.254: COL_D_HL.13 92.83,51.12 94.74,49.21 106.01,49.21 107.76,47.46 107.76,46.99 SOURCE_D.3
N$38
  Top 0.254: COL_A_L.15 66.48,13.02 66.48,17.78 SINK_A.1
N$39
  Top 0.254: COL_A_L.14 69.02,13.02 69.02,17.78 SINK_A.2
N$40
  Top 0.254: COL_A_L.13 71.56,13.02 71.56,17.78 SINK_A.3
N$41
  Top 0.254: COL_A_L.12 74.1,13.02 74.1,17.78 SINK_A.4
N$42
  Top 0.254: COL_A_L.11 76.64,13.02 76.64,17.78 SINK_A.5
N$43
  Top 0.254: COL_A_L.10 79.18,13.02 79.18,17.78 SINK_A.6
N$44
  Top 0.254: COL_A_L.9 81.72,13.02 81.72,17.78 SINK_A.7
N$45
  Top 0.254: COL_B_L.15 43.46,13.02 43.46,18.1 SINK_B.1
N$46
  Top 0.254: COL_B_L.14 46,13.02 46,18.1 SINK_B.2
N$47
  Top 0.254: COL_B_L.13 48.54,13.02 48.54,18.1 SINK_B.3
N$48
  Top 0.254: COL_B_L.12 51.08,13.02 51.08,18.1 SINK_B.4
N$49
  Top 0.254: COL_B_L.11 53.62,13.02 53.62,18.1 SINK_B.5
N$50
  Top 0.254: COL_B_L.10 56.16,13.02 56.16,18.1 SINK_B.6
N$51
  Top 0.254: COL_B_L.9 58.7,13.02 58.7,18.1 SINK_B.7
N$52
  Top 0.254: SINK_C.1 64.42,46.83 64.42,51.59 COL_C_L.15
N$53
  Top 0.254: SINK_C.2 61.88,46.83 61.88,51.59 COL_C_L.14
N$54
  Top 0.254: SINK_C.3 59.34,46.83 59.34,51.59 COL_C_L.13
N$55
  Top 0.254: SINK_C.4 56.8,46.83 56.8,51.59 COL_C_L.12
N$56
  Top 0.254: SINK_C.5 54.26,46.83 54.26,51.59 COL_C_L.11
N$57
  Top 0.254: SINK_C.6 51.72,46.83 51.72,51.59 COL_C_L.10
N$58
  Top 0.254: SINK_C.7 49.18,46.83 49.18,51.59 COL_C_L.9
N$59
  Top 0.254: SINK_D.1 87.44,46.99 87.44,48.26 85.21,50.48 85.21,51.12 COL_D_HL.10
N$60
  Top 0.254: SINK_D.2 84.9,46.99 84.9,48.26 82.67,50.48 82.67,51.12 COL_D_HL.9
N$61
  Top 0.254: SINK_D.3 82.36,46.99 82.36,48.58 81.09,49.85 81.09,53.81 85.06,57.78 85.06,58.74 COL_D_HL.7
N$62
  Top 0.254: ROW_L.1 135.22,54.61 135.85,54.61 137.92,52.54 137.92,31.91 136.01,30 ROW_H.1
  Bottom 0.254: U$6.P$4 132.52,10.48 137.44,10.48 138.39,11.43 138.39,29.68 136.33,29.68 136.17,29.84 ROW_H.1
N$63
  Top 0.254: U$6.P$3 134.11,5.4 137.92,5.4 139.35,6.82 139.35,24.29 136.17,27.46 ROW_H.2
  Bottom 0.254: ROW_L.2 135.22,52.07 137.44,49.85 137.44,31.27 134.74,31.27 133.79,30.32 133.79,27.46 136.01,27.46 ROW_H.2
N$64
  Top 0.254: U$6.P$2 136.17,5.87 137.76,5.87 138.87,6.98 138.87,22.22 136.17,24.92 ROW_H.3
  Bottom 0.254: ROW_L.3 135.06,49.53 134.74,49.21 134.11,49.21 132.84,47.94 132.84,24.92 136.01,24.92 ROW_H.3
N$65
  Top 0.254: U$6.P$1 137.12,7.78 138.39,9.05 138.39,20.32 136.49,22.22 136.17,22.22 ROW_H.4 136.01,22.38 135.7,22.38 133.95,24.13 133.95,30.48 137.44,33.97 137.44,40.32 135.85,41.91 135.22,41.91 ROW_L.6
N$66
  Top 0.254: SINK_R.1 124.11,49.53 127.44,49.53 ROW_L.14
N$67
  Top 0.254: SINK_R.2 124.11,46.99 127.44,46.99 ROW_L.13
N$68
  Top 0.254: SINK_R.3 124.11,44.45 127.44,44.45 ROW_L.12
N$69
  Top 0.254: SINK_R.4 124.11,41.91 127.44,41.91 ROW_L.11
N$70
  Top 0.254: SINK_R.5 124.11,39.37 127.44,39.37 ROW_L.10
N$71
  Top 0.254: SINK_R.6 124.11,36.83 127.44,36.83 ROW_L.9
N$72
  Top 0.254: SINK_R.7 124.11,34.45 129.5,34.45 134.43,39.37 135.06,39.37 ROW_L.7
N$73
  Top 0.254: SOURCE_R.1 124.11,27.14 125.54,27.14 127.76,24.92 128.39,24.92 ROW_H.14
N$74
  Top 0.254: SOURCE_R.2 124.11,24.6 125.54,24.6 127.76,22.38 128.39,22.38 ROW_H.13
N$75
  Top 0.254: SOURCE_R.3 124.11,22.06 125.54,22.06 127.76,19.84 128.39,19.84 ROW_H.12
N$76
  Top 0.254: SOURCE_R.4 124.11,19.52 125.54,19.52 127.76,17.3 128.39,17.3 ROW_H.11
N$77
  Top 0.254: SOURCE_R.5 124.11,16.98 125.54,16.98 127.76,14.76 128.39,14.76 ROW_H.10
N$78
  Top 0.254: SOURCE_R.6 124.11,14.44 125.54,14.44 127.76,12.22 128.39,12.22 ROW_H.9
N$79
  Bottom 0.254: SOURCE_R.7 124.11,11.9 125.38,10.63 130.46,10.63 134.58,14.76 136.01,14.76 ROW_H.7
N$80
  Top 0.254: U$10.S4 11.4,50.48 4.73,50.48 U$11.P$4
R1H
  Bottom 0.254: U$1.R1H 86.48,30.32 88.39,28.41 88.39,20 110.77,20 114.27,16.51 114.27,12.7 114.58,12.7 115.22,12.06 116.33,12.06 SOURCE_R.12
R1L
  Bottom 0.254: U$1.R1L 86.48,33.02 89.98,36.51 113.15,36.51 115.06,38.42 117.6,38.42 118.71,39.53 118.71,49.05 117.76,49.05 117.28,49.53 116.49,49.53 SINK_R.16
R2H
  Bottom 0.254: U$1.R2H 89.02,30.32 91.41,27.94 91.41,20.48 110.93,20.48 116.33,15.08 116.33,14.6 SOURCE_R.13
R2L  (via drill 0.3)
  Top 0.254: v94.58,44.29 89.02,38.73 89.02,33.02 U$1.R2L
  Bottom 0.254: v94.58,44.29 95.06,44.77 113.63,44.77 115.85,46.99 116.33,46.99 SINK_R.15
R3H
  Bottom 0.254: U$1.R3H 91.56,30.32 94.26,27.62 95.37,27.62 96.48,26.51 96.48,20.95 111.41,20.95 115.22,17.14 116.33,17.14 SOURCE_R.14
R3L
  Top 0.254: U$1.R3L 91.56,33.02 96.64,38.1 96.64,40.64 100.3,44.29 116.17,44.29 116.33,44.45 SINK_R.14
R4H
  Bottom 0.254: U$1.R4H 94.1,30.32 96.8,27.62 110.93,27.62 113.79,24.76 113.79,19.84 116.17,19.84 116.33,19.68 SOURCE_R.15
R4L
  Top 0.254: U$1.R4L 94.1,33.02 99.18,38.1 99.18,40.64 100.45,41.91 116.33,41.91 SINK_R.13
R5H
  Bottom 0.254: U$1.R5H 96.64,30.32 98.87,28.1 111.09,28.1 114.27,24.92 114.27,22.38 116.17,22.38 116.33,22.22 SOURCE_R.16
R5L
  Top 0.254: U$1.R5L 96.64,33.02 100.77,37.15 113.63,37.15 115.85,39.37 116.33,39.37 SINK_R.12
R6H
  Bottom 0.254: U$1.R6H 99.18,30.32 100.93,28.57 111.41,28.57 115.22,24.76 116.33,24.76 SOURCE_R.17
R6L
  Bottom 0.254: U$1.R6L 99.18,33.02 102.2,36.03 114.11,36.03 115.06,36.99 116.33,36.99 SINK_R.11
R7H
  Bottom 0.254: U$1.R7H 101.72,30.32 102.99,29.05 113,29.05 114.9,27.14 116.33,27.14 SOURCE_R.18
R7L
  Bottom 0.254: U$1.R7L 101.72,33.02 102.99,34.29 116.33,34.29 SINK_R.10
SEG_1
  Top 0.254: U$10.X1 15.36,58.1 15.36,55.72 U$10.X2 15.36,55.56 15.36,53.18 U$10.X3 15.36,53.02 15.36,50.64 U$10.X4 15.21,50.48 8.54,43.81 8.54,24.29 3.62,19.37 3.14,19.37 SUBSEG.6

### Text on the board
tNames: Seg. Sel. | RA RB RC RE
tDocu: GND 5V 10V | EA EB EC | The cake is a lie. | A B C